# EAGLE schematic RFID_reader_v2 (EAGLE 9.0.1)
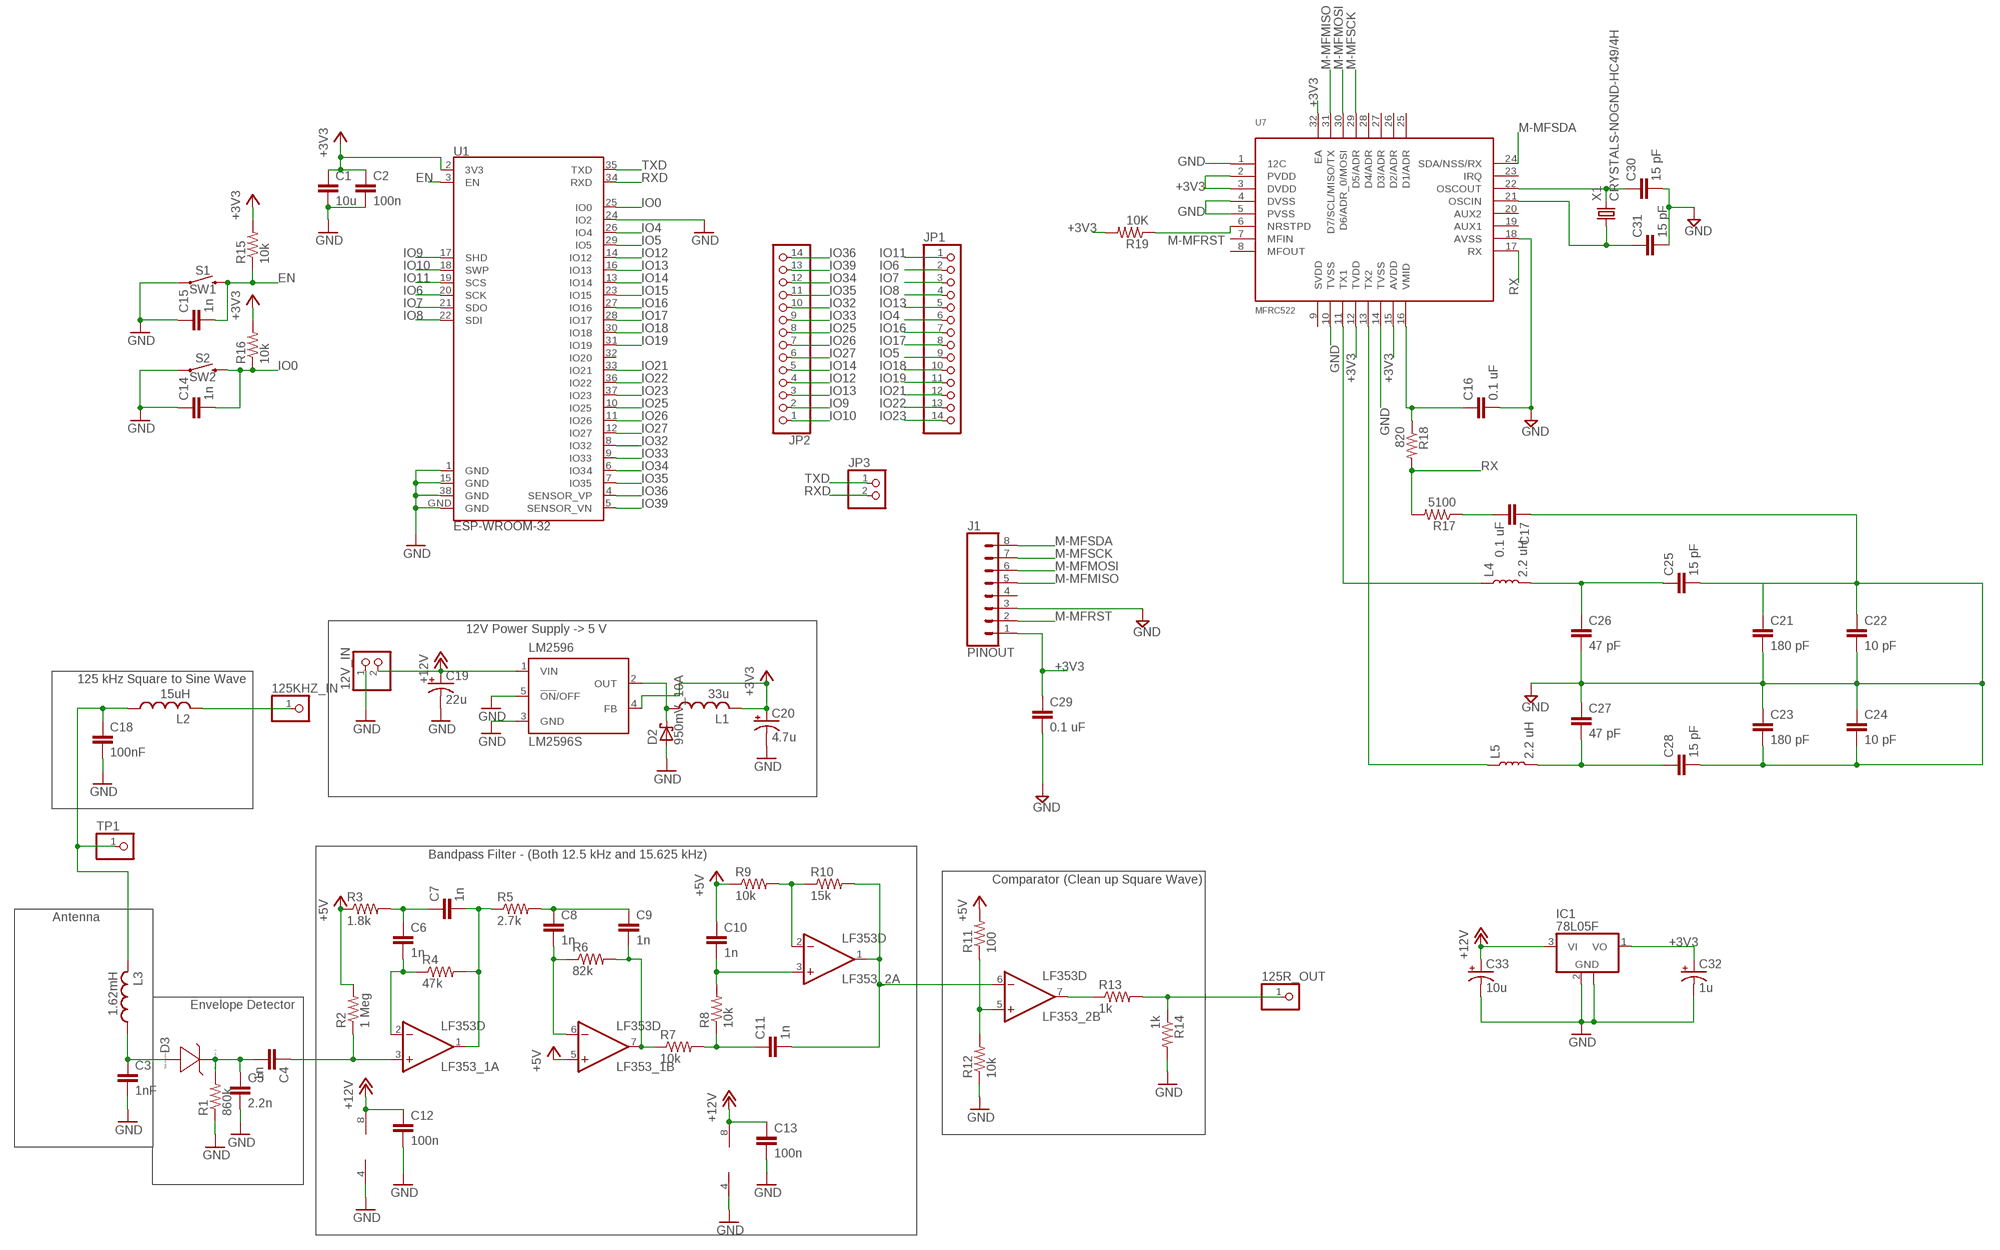
[diagram p0: schematic, sheet 1]

## Parts
12V_IN  PINHD-1X2  [1X02]
125KHZ_IN  PINHD-1X1  [1X01]
125R_OUT  PINHD-1X1  [1X01]
C1  10u  C-EUC0805  [C0805]
C2  100n  C-EUC0805  [C0805]
C3  1nF  C-EUC0805  [C0805]
C4  1n  C-EUC0805  [C0805]
C5  2.2n  C-EUC0805  [C0805]
C6  1n  C-EUC0805  [C0805]
C7  1n  C-EUC0805  [C0805]
C8  1n  C-EUC0805  [C0805]
C9  1n  C-EUC0805  [C0805]
C10  1n  C-EUC0805  [C0805]
C11  1n  C-EUC0805  [C0805]
C12  100n  C-EUC0805  [C0805]
C13  100n  C-EUC0805  [C0805]
C14  1n  C-EUC0805  [C0805]
C15  1n  C-EUC0805  [C0805]
C16  0.1 uF  C-EUC0603  [C0603]
C17  0.1 uF  C-EUC0603  [C0603]
C18  100nF  C-EUC0805  [C0805]
C19  22u  CPOL-USSANYO_SMD_B6  [SANYO-OSCON_SMD_B6]
C20  4.7u  CPOL-USSMCC  [SMC_C]
C21  180 pF  C-EUC0603  [C0603]
C22  10 pF  C-EUC0603  [C0603]
C23  180 pF  C-EUC0603  [C0603]
C24  10 pF  C-EUC0603  [C0603]
C25  15 pF  C-EUC0603  [C0603]
C26  47 pF  C-EUC0603  [C0603]
C27  47 pF  C-EUC0603  [C0603]
C28  15 pF  C-EUC0603  [C0603]
C29  0.1 uF  C-EUC0603  [C0603]
C30  15 pF  C-EUC0603  [C0603]
C31  15 pF  C-EUC0603  [C0603]
C32  1u  CPOL-USSMCA  [SMC_A]
C33  10u  CPOL-USSMCC  [SMC_C]
D2  950mV_10A  SCHOTTKY-DIODESMC  [SMC]
D3  ZENER  [SOD123]
IC1  78L05F  [SOT89]
J1  PINOUT  CONN_08NO_SILK_FEMALE_PTH  [1X08_NO_SILK]
JP1  PINHD-1X14  [1X14]
JP2  PINHD-1X14  [1X14]
JP3  PINHD-1X2  [1X02]
L1  33u  L-US0207/10  [0207/10]
L2  15uH  L-USL2012C  [L2012C]
L3  1.62mH  L-US0207/10  [0207/10]
L4  2.2 uH  INDUCTOR-0603-33NH  [0603]
L5  2.2 uH  INDUCTOR-0603-33NH  [0603]
LF353_1  LF353D  [SO08]
LF353_2  LF353D  [SO08]
LM2596  LM2596S  [TO263-5]
R1  860k  R-US_R0805  [R0805]
R2  1 Meg  R-US_R0805  [R0805]
R3  1.8k  R-US_R0805  [R0805]
R4  47k  R-US_R0805  [R0805]
R5  2.7k  R-US_R0805  [R0805]
R6  82k  R-US_R0805  [R0805]
R7  10k  R-US_R0805  [R0805]
R8  10k  R-US_R0805  [R0805]
R9  10k  R-US_R0805  [R0805]
R10  15k  R-US_R0805  [R0805]
R11  100  R-US_R0805  [R0805]
R12  10k  R-US_R0805  [R0805]
R13  1k  R-US_R0805  [R0805]
R14  1k  R-US_R0805  [R0805]
R15  10k  R-US_R0805  [R0805]
R16  10k  R-US_R0805  [R0805]
R17  5100  R-US_R0603  [R0603]
R18  820  R-US_R0603  [R0603]
R19  10K  R-US_R0603  [R0603]
S1  SW1  MOMENTARY-SWITCH-SPST-SMD-6.0X3.5MM  [TACTILE_SWITCH_SMD_6.0X3.5MM]
S2  SW2  MOMENTARY-SWITCH-SPST-SMD-6.0X3.5MM  [TACTILE_SWITCH_SMD_6.0X3.5MM]
TP1  PINHD-1X1  [1X01]
U1  ESP-WROOM-32  [ESP-WROOM-32]
U7  MFRC522  [MFR522]
X1  CRYSTALS-NOGND-HC49/4H  [HC49]

## Nets
+3V3: C1.1 C2.1 C20.+ C29.1 C32.+ IC1.1(VO) J1.1 L1.2 LM2596.4(FB) R15.2 R16.2 R19.2 U1.2(3V3) U7.2(PVDD) U7.3(DVDD) U7.12(TVDD) U7.15(AVDD) U7.32(EA)
+5V: C10.1 LF353_1.5(B:+IN) R2.2 R3.1 R9.1 R11.2
+12V: 12V_IN.2 C12.1 C13.1 C19.+ C33.+ IC1.3(VI) LF353_1.8(P:V+) LF353_2.8(P:V+) LM2596.1(VIN)
EN: C15.2 R15.1 S1.2 U1.3(EN)
GND: 12V_IN.1 C1.2 C2.2 C3.2 C5.2 C12.2 C13.2 C14.1 C15.1 C16.2 C17.1 C18.2 C19.- C20.- C21.1 C21.2 C22.1 C22.2 C23.1 C23.2 C24.1 C24.2 C25.2 C26.2 C27.1 C28.2 C29.2 C30.2 C31.2 C32.- C33.- D2.A IC1.2(GND) IC1.2@1(GND) J1.3 LF353_1.4(P:V-) LF353_2.4(P:V-) LM2596.3(GND) LM2596.5(!ON!/OFF) R1.1 R12.1 R14.2 S1.1 S2.1 U1.1(GND) U1.15(GND) U1.24(IO2) U1.38(GND) U1.GND U7.1(12C) U7.4(DVSS) U7.5(PVSS) U7.10(TVSS) U7.14(TVSS) U7.18(AVSS)
IO0: C14.2 R16.1 S2.2 U1.25(IO0)
IO4: JP1.6 U1.26(IO4)
IO5: JP1.9 U1.29(IO5)
IO6: JP1.2 U1.20(SCK)
IO7: JP1.3 U1.21(SDO)
IO8: JP1.4 U1.22(SDI)
IO9: JP2.2 U1.17(SHD)
IO10: JP2.1 U1.18(SWP)
IO11: JP1.1 U1.19(SCS)
IO12: JP2.4 U1.14(IO12)
IO13: JP1.5 JP2.3 U1.16(IO13)
IO14: JP2.5 U1.13(IO14)
IO15: U1.23(IO15)
IO16: JP1.7 U1.27(IO16)
IO17: JP1.8 U1.28(IO17)
IO18: JP1.10 U1.30(IO18)
IO19: JP1.11 U1.31(IO19)
IO21: JP1.12 U1.33(IO21)
IO22: JP1.13 U1.36(IO22)
IO23: JP1.14 U1.37(IO23)
IO25: JP2.8 U1.10(IO25)
IO26: JP2.7 U1.11(IO26)
IO27: JP2.6 U1.12(IO27)
IO32: JP2.10 U1.8(IO32)
IO33: JP2.9 U1.9(IO33)
IO34: JP2.12 U1.6(IO34)
IO35: JP2.11 U1.7(IO35)
IO36: JP2.14 U1.4(SENSOR_VP)
IO39: JP2.13 U1.5(SENSOR_VN)
M-MFMISO: J1.5 U7.31(D7/SCL/MISO/TX)
M-MFMOSI: J1.6 U7.30(D6/ADR_0/MOSI)
M-MFRST: J1.2 R19.1 U7.6(NRSTPD)
M-MFSCK: J1.7 U7.29(D5/ADR)
M-MFSDA: J1.8 U7.24(SDA/NSS/RX)
N$1: C4.2 C5.1 D3.C(-) R1.2
N$2: C4.1 LF353_1.3(A:+IN) R2.1
N$3: D2.C L1.1 LM2596.2(OUT)
N$4: C3.1 D3.A(+) L3.1
N$5: 125KHZ_IN.1 L2.2
N$6: C6.1 C7.1 R3.2
N$7: C6.2 LF353_1.2(A:-IN) R4.1
N$8: C8.1 C9.1 R5.2
N$9: C7.2 LF353_1.1(A:OUT) R4.2 R5.1
N$10: C8.2 LF353_1.6(B:-IN) R6.1
N$11: C9.2 LF353_1.7(B:OUT) R6.2 R7.1
N$12: C11.1 R7.2 R8.1
N$13: C10.2 LF353_2.3(A:+IN) R8.2
N$14: C17.2 R17.1
N$15: LF353_2.2(A:-IN) R9.2 R10.1
N$16: C11.2 LF353_2.1(A:OUT) LF353_2.6(B:-IN) R10.2
N$17: C18.1 L2.1 L3.2 TP1.1
N$18: LF353_2.5(B:+IN) R11.1 R12.2
N$19: LF353_2.7(B:OUT) R13.1
N$20: 125R_OUT.1 R13.2 R14.1
N$21: C27.2 C28.1 L5.2
N$22: C25.1 C26.1 L4.2
OSCIN: C31.1 U7.21(OSCIN) X1.1
OSCOUT: C30.1 U7.22(OSCOUT) X1.2
RX: R17.2 R18.2 U7.17(RX)
RXD: JP3.2 U1.34(RXD)
TX1: L4.1 U7.11(TX1)
TX2: L5.1 U7.13(TX2)
TXD: JP3.1 U1.35(TXD)
VMID: C16.1 R18.1 U7.16(VMID)
Unconnected: J1.4 U1.32(IO20) U7.7(MFIN) U7.8(MFOUT) U7.9(SVDD) U7.19(AUX1) U7.20(AUX2) U7.23(IRQ) U7.25(D1/ADR) U7.26(D2/ADR) U7.27(D3/ADR) U7.28(D4/ADR)

## Notes on the sheet
- 12V Power Supply -> 5 V
- 125 kHz Square to Sine Wave
- Bandpass Filter - (Both 12.5 kHz and 15.625 kHz)
- Comparator (Clean up Square Wave)
- Antenna
- Envelope Detector

## Library data of the parts
12V_IN JP3 = pinhead:PINHD-1X2: PIN HEADER
125KHZ_IN 125R_OUT TP1 = pinhead:PINHD-1X1: PIN HEADER
C1-C18 C21-C31 = rcl:C-EU: CAPACITOR, European symbol; SPICEPREFIX: C
C19 C20 C32 C33 = rcl:CPOL-US: POLARIZED CAPACITOR, American symbol; SPICEPREFIX: C
D2 = diode:SCHOTTKY-DIODE: Schottky Diode
D3 = sym:ZENER: Zener Diode
IC1 = linear:78L*: POSITOIV-VOLTAGE REGULATORS Output up to 100 mA Source: Datasheet <http://focus.ti.com/lit/ds/symlink/ua78l05.pdf>
J1 = SparkFun-Connectors:CONN_08: Multi connection point. Often used as Generic Header-pin footprint for 0.1 inch spaced/style header connections On any of the 0.1 inch spaced packages, you can populate with these: Break Away Headers - Straight <https://www.sparkfun.com/products/116> (PRT-00116) Break Away Male Headers - Right Angle <https://www.sparkfun.com/products/553> (PRT-00553) Female Headers <https://www.sparkfun.com/products/115> (PRT-00115) Break Away Headers - Machine Pin <https://www.sparkfun.com/products/117> (PRT-00117) Break Away Female Headers - Swiss Machine Pin <https://www.sparkfun.com/products/743> (PRT-00743) Arduino Stackable Header - 8 Pin <https://www.sparkfun.com/products/9279> (PRT-09279) For SCREWTERMINALS and SPRING TERMINALS visit here: Screw Terimnals on SparkFun.com <https://www.sparkfun.com/search/results?term=Screw+Terminals> (5mm/3.5mm/2.54mm spacing) This device is also useful as a general connection point to wire up your design to another part of your project. Our various solder wires solder well into these plated through hole pads. Hook-Up Wire - Assortment (Stranded, 22 AWG) <https://www.sparkfun.com/products/11375> (PRT-11375) Hook-Up Wire - Assortment (Solid Core, 22 AWG) <https://www.sparkfun.com/products/11367> (PRT-11367) View the entire wire category on our website here <https://www.sparkfun.com/categories/141> Special notes: Molex polarized connector foot print use with SKU : PRT-08231 with associated crimp pins and housings. 1MM SMD Version SKU: PRT-10208 NOTES ON THE VARIANTS LOCK and LOCK_LONGPADS... This footprint was designed to help hold the alignment of a through-hole component (i.e. 6-pin header) while soldering it into place. You may notice that each hole has been shifted either up or down by 0.005 of an inch from it's more standard position (which is a perfectly straight line). This slight alteration caused the pins (the squares in the middle) to touch the edges of the holes. Because they are alternating, it causes a "brace" to hold the component in place. 0.005 has proven to be the perfect amount of "off-center" position when using our standard breakaway headers. Although looks a little odd when you look at the bare footprint, once you have a header in there, the alteration is very hard to notice. Also,if you push a header all the way into place, it is covered up entirely on the bottom side.; PROD_ID: CONN-08438
JP1 JP2 = pinhead:PINHD-1X14: PIN HEADER
L1-L3 = rcl:L-US: INDUCTOR, American symbol; SPICEPREFIX: L
L4 L5 = SparkFun-Coils:INDUCTOR: Inductors Resist changes in electrical current. Basically a coil of wire. SparkFun Products: SparkFun Load Cell Amplifier - HX711 <https://www.sparkfun.com/products/13879> IOIO-OTG - V2.2 <https://www.sparkfun.com/products/13613>; PROD_ID: NDUC-07874; VALUE: 33nH/±5%/500mA
LF353_1 = linear:LF353: OP AMP; SPICEPREFIX: J
LF353_2 = linear:LF353: OP AMP
LM2596 = national-semiconductor:LM2596: SIMPLE SWITCHER® Power Converter 150 kHz 3A Step-Down Voltage Regulator Source: http://www.national.com/ds/LM/LM2596.pdf; MF: NATIONAL SEMICONDUCTOR; MPN: LM2596S-ADJ/NOPB; OC_FARNELL: 9494367; OC_NEWARK: 41K3842
R1-R19 = rcl:R-US_: RESISTOR, American symbol; SPICEPREFIX: R
S1 S2 = SparkFun-Switches:MOMENTARY-SWITCH-SPST: Momentary Switch (Pushbutton) - SPST Normally-open (NO) SPST momentary switches (buttons, pushbuttons). Variants PTH-12MM - 12mm square, through-hole Momentary Pushbutton Switch - 12mm Square <https://www.sparkfun.com/products/9190> (COM-09190) PTH-6.0MM, PTH-6.0MM-KIT - 6.0mm square, through-hole Mini Pushbutton Switch <https://www.sparkfun.com/products/97> (COM-00097) KIT package intended for soldering kit's - only one side of pads' copper is exposed. PTH-RIGHT-ANGLE-KIT - Right-angle, through-hole Right Angle Tactile Button <https://www.sparkfun.com/products/10791> - Used on SparkFun BigTime Watch Kit <https://www.sparkfun.com/products/11734> SMD-12MM - 12mm square, surface-mount Tactile Button - SMD (12mm) <https://www.sparkfun.com/products/12993> (COM-12993) Used on SparkFun PicoBoard <https://www.sparkfun.com/products/11888> SMD-4.5MM - 4.5mm Square Trackball Switch Used on SparkFun Blackberry Trackballer Breakout <https://www.sparkfun.com/products/13169> SMD-4.6MMX2.8MM - 4.60mm x 2.80mm, surface mount Used on SparkFun SAMD21 Mini Breakout <https://www.sparkfun.com/products/13664> SMD-5.2MM, SMD-5.2-REDUNDANT - 5.2mm square, surface-mount Mini Pushbutton Switch - SMD <https://www.sparkfun.com/products/8720> (COM-08720) Used on Arduino Pro Mini <https://www.sparkfun.com/products/11114> REDUNDANT package connects both switch circuits together SMD-6.0X3.5MM - 6.0 x 3.5mm, surface mount Momentary Reset Switch SMD <https://www.sparkfun.com/products/8229> (COM-08229) SMD-6.2MM-TALL - 6.2mm square, surface mount Tactile Button - SMD (6mm) <https://www.sparkfun.com/products/12992> Used on SparkFun Digital Sandbox <https://www.sparkfun.com/products/12651> SMD-RIGHT-ANGLE - Right-angle, surface mount Used on SparkFun Block for Intel® Edison - Arduino <https://www.sparkfun.com/products/13036>; PROD_ID: SWCH-00815; SF_SKU: COM-08229
U1 = SparkFun-RF:ESP-WROOM-32; PROD_ID: IC-13849
U7 = mfrc:MFRC522
X1 = IQD-Frequency-Products:CRYSTALS-NOGND: CRYSTALS CAN NOT GROUNDED